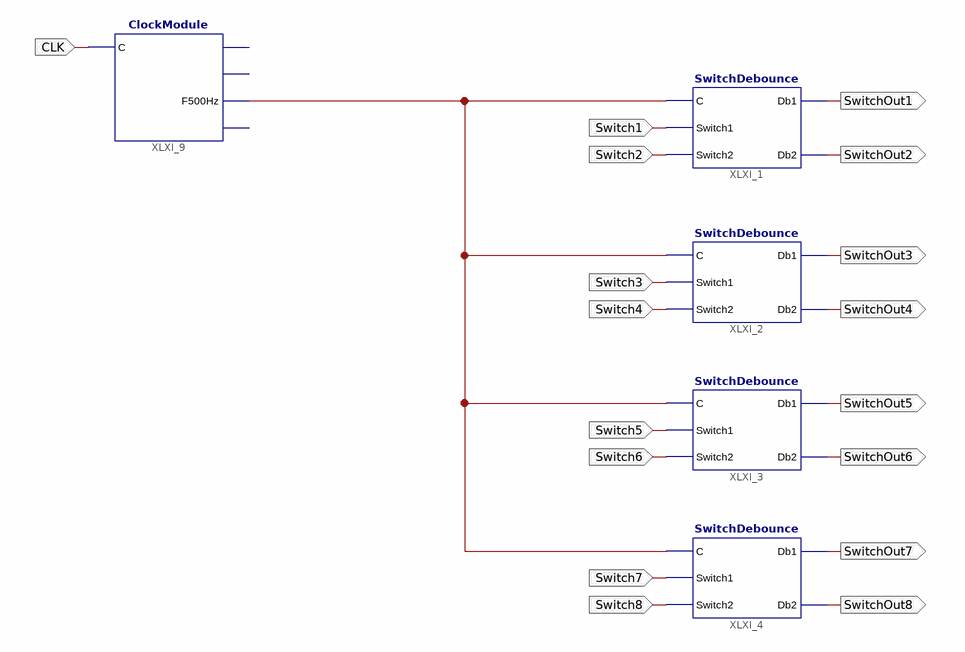
[diagram p0: schematic sheet 1]
// Xilinx ISE schematic KeyDebouncer.sch (spartan6) as structural Verilog: 5 symbols, 17 ports
module KeyDebouncer (
  input  CLK,
  input  Switch1,
  input  Switch2,
  input  Switch3,
  input  Switch4,
  input  Switch5,
  input  Switch6,
  input  Switch7,
  input  Switch8,
  output SwitchOut8,
  output SwitchOut7,
  output SwitchOut6,
  output SwitchOut5,
  output SwitchOut4,
  output SwitchOut3,
  output SwitchOut2,
  output SwitchOut1
);

  wire XLXN_3;

  SwitchDebounce XLXI_1 (.C(XLXN_3), .Switch1(Switch1), .Switch2(Switch2), .Db1(SwitchOut1), .Db2(SwitchOut2));
  SwitchDebounce XLXI_2 (.C(XLXN_3), .Switch1(Switch3), .Switch2(Switch4), .Db1(SwitchOut3), .Db2(SwitchOut4));
  SwitchDebounce XLXI_3 (.C(XLXN_3), .Switch1(Switch5), .Switch2(Switch6), .Db1(SwitchOut5), .Db2(SwitchOut6));
  SwitchDebounce XLXI_4 (.C(XLXN_3), .Switch1(Switch7), .Switch2(Switch8), .Db1(SwitchOut7), .Db2(SwitchOut8));
  ClockModule XLXI_9 (.C(CLK), .F500Hz(XLXN_3));  // open: F1Hz, F2Hz, F50MHz
endmodule
